# Altium schematic sheet POWER.SchDoc
size A4; SheetNumber: 2; SheetTotal: 5
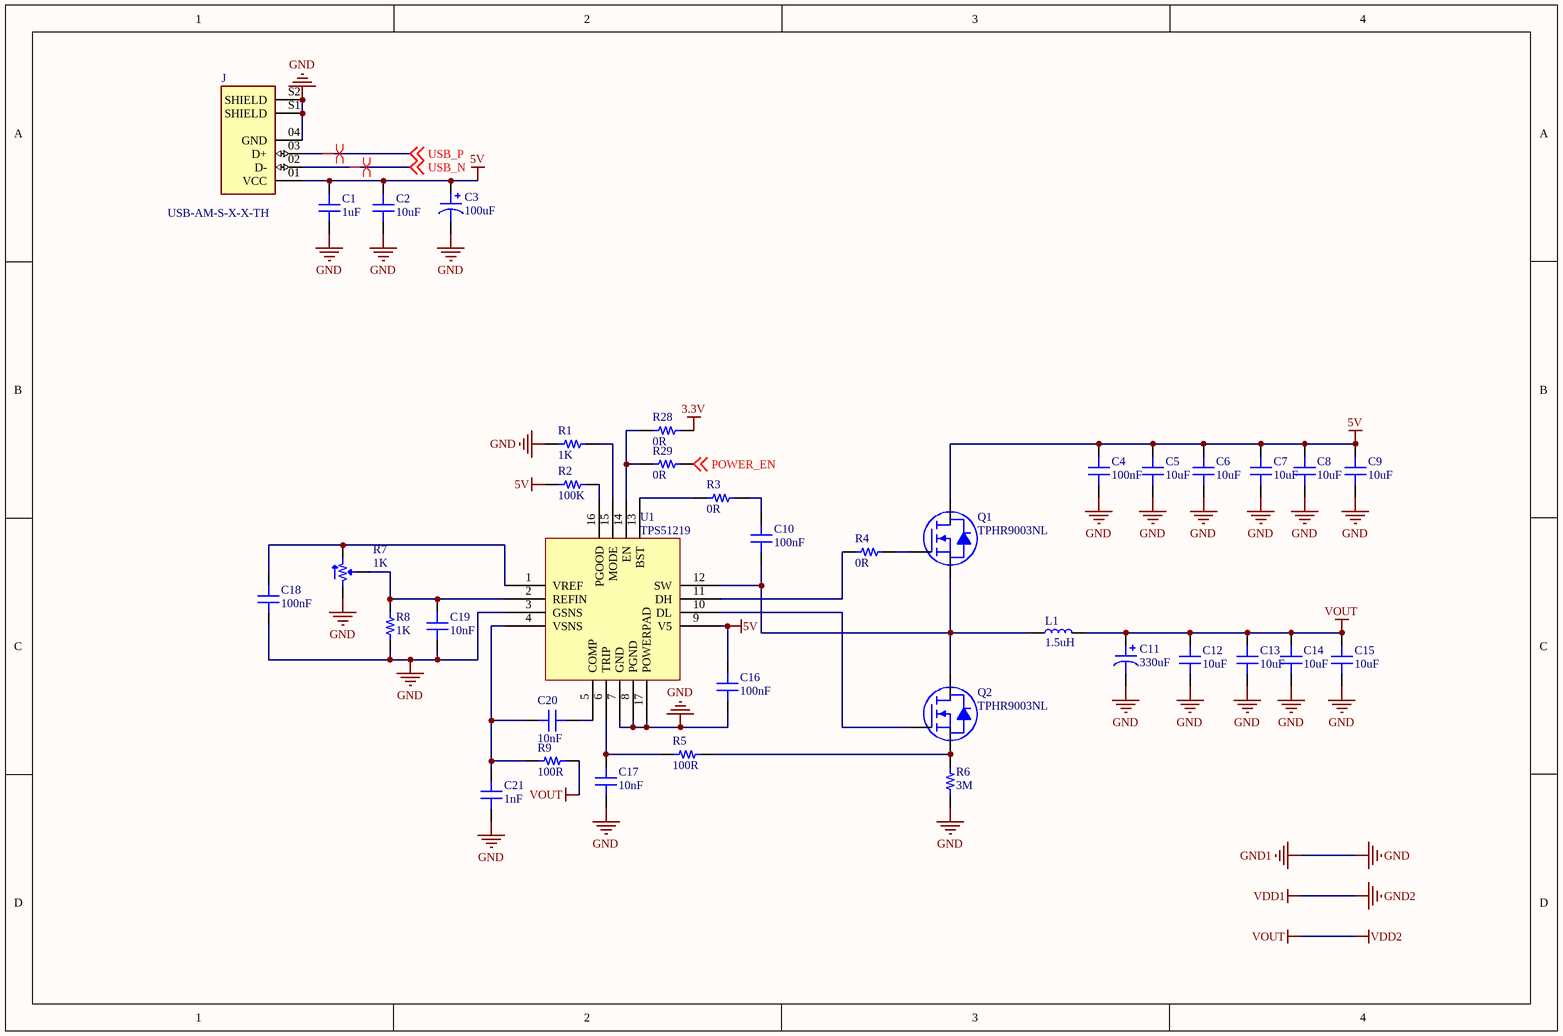
[diagram p0: POWER.SchDoc]

## Parts
C1  1uF  [CAP_SMD_1206]
C2  10uF  [CAP_SMD_1206]
C3  100uF  [CAP-TAN-CASE-B]
C4  100nF  [CAP-SMD-0603]
C5  10uF  [CAP-SMD-0603]
C6  10uF  [CAP-SMD-0603]
C7  10uF  [CAP-SMD-0603]
C8  10uF  [CAP-SMD-0603]
C9  10uF  [CAP-SMD-0603]
C10  100nF  [CAP-SMD-0603]
C11  330uF  [CAP-TAN-CASE-E]
C12  10uF  [CAP-SMD-0603]
C13  10uF  [CAP-SMD-0603]
C14  10uF  [CAP-SMD-0603]
C15  10uF  [CAP-SMD-0603]
C16  100nF  [CAP-SMD-0603]
C17  10nF  [CAP-SMD-0603]
C18  100nF  [CAP-SMD-0603]
C19  10nF  [CAP-SMD-0603]
C20  10nF  [CAP-SMD-0603]
C21  1nF  [CAP-SMD-0603]
J  USB-AM-S-X-X-TH  [SAMTEC_USB-AM-S-X-X-TH]
L1  1.5uH  [IND]
Q1  TPHR9003NL  [ADVANCE SOP]
Q2  TPHR9003NL  [ADVANCE SOP]
R1  1K  [RES-SMD-0402]
R2  100K  [RES-SMD-0402]
R3  0R  [RES-SMD-0402]
R4  0R  [RES-SMD-0402]
R5  100R  [RES-SMD-0402]
R6  3M  [RES-SMD-0402]
R7  1K  [POT]
R8  1K  [RES-SMD-0402]
R9  100R  [RES-SMD-0402]
R28  0R  [RES-SMD-0402]
R29  0R  [RES-SMD-0402]
U1  TPS51219  [QFN50P300X300X80-17N]

## Nets
3.3V: R28.2
5V: C1.1 C2.1 C3.1 C4.1 C5.1 C6.1 C7.1 C8.1 C9.1 C16.1 J.01(VCC) Q1.D R2.2 U1.9(V5)
GND: C1.2 C2.2 C3.2 C4.2 C5.2 C6.2 C7.2 C8.2 C9.2 C11.2 C12.2 C13.2 C14.2 C15.2 C16.2 C17.2 C18.1 C19.1 C21.1 J.04(GND) J.S1(SHIELD) J.S2(SHIELD) R1.2 R6.2 R7.1 R8.2 U1.3(GSNS) U1.7(GND) U1.8(PGND) U1.17(POWERPAD)  [also labelled GND1]
VDD2: C11.1 C12.1 C13.1 C14.1 C15.1 L1.2 R9.1  [also labelled VOUT]
POWER_EN: R29.2 ; off-sheet POWER_EN
USB_N: J.02(D-) ; off-sheet USB_N
USB_P: J.03(D+) ; off-sheet USB_P
NetC10_1: C10.1 R3.1
NetC10_2: C10.2 L1.1 Q1.S Q2.D U1.12(SW)
NetC17_1: C17.1 R5.2 U1.6(TRIP)
NetC18_2: C18.2 R7.3 U1.1(VREF)
NetC19_2: C19.2 R7.2 R8.1 U1.2(REFIN)
NetC20_1: C20.1 C21.2 R9.2 U1.4(VSNS)
NetC20_2: C20.2 U1.5(COMP)
NetQ1_G: Q1.G R4.1
NetQ2_G: Q2.G U1.10(DL)
NetQ2_S: Q2.S R5.1 R6.1
NetR1_1: R1.1 U1.15(MODE)
NetR2_1: R2.1 U1.16(PGOOD)
NetR3_2: R3.2 U1.13(BST)
NetR4_2: R4.2 U1.11(DH)
NetR28_1: R28.1 R29.1 U1.14(EN)

## Layout directives
differential pair: USB_N, USB_P

## Library data of the parts
C1 C2 C4-C10 C12-C21 = CAP
C3 C11 = POLARIZED CAP
J = USB-AM-S-X-X-TH: USB-A (USB TYPE-A) USB 2.0 Plug Connector 4 Position Through Hole, Right Angle; MF: Samtec; MP: USB-AM-S-F-B-TH; Toby_UK-Purchase-URL: https://snapeda.com/shop?store=Toby+UK&id=474273; Price: None; SnapEDA_Link: https://www.snapeda.com/parts/USB-AM-S-F-B-TH/Samtec%20Inc./view-part/474273/?ref=snap; Availability: Unavailable; Package: None; Value: *
L1 = INDUCTOR
Q1 Q2 = MOSFET-N
R1-R6 R8 R9 R28 R29 = RES
R7 = Potentiometer